# Altium schematic sheet PowerSupply.SchDoc
size Letter
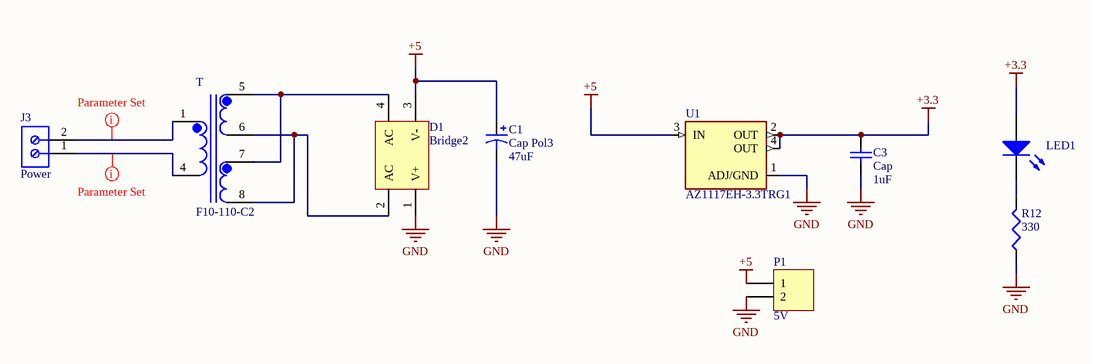
[diagram p0: PowerSupply.SchDoc]

## Parts
C1  Cap Pol3  value 47uF  [2.5mmCap]
C3  Cap  value 1uF  [1608[0603]]
D1  Bridge2  [SOP250P700X300-4N]
J3  Power  [691137710002]
LED1  150120BS75000  [1206_A]  (value not drawn)
P1  5V  [HDR1X2H]
R12  value 330  [1608[0603]]  (hidden comment: Res3)
T  F10-110-C2  [XFMR_F10-110]
U1  AZ1117EH-3.3TRG1  [SOT230P700X180-4N]

## Nets
+3.3: C3.2 LED1.2(A) U1.2(OUT) U1.4(OUT)
+5: C1.1 D1.3(V-) P1.1 U1.3(IN)
GND: C1.2 C3.1 D1.1(V+) P1.2 R12.1 U1.1(ADJ/GND)
NetD1_2: D1.2(AC) T.6 T.8
NetD1_4: D1.4(AC) T.5 T.7
NetJ3_1: J3.1 T.4
NetJ3_2: J3.2 T.1
NetLED1_1: LED1.1(K) R12.2

## Layout directives
rule Width Constraint [Pref Width = 2mm    Min Width = 2mm    Max Width = 2mm]: NetJ3_1, NetJ3_2

## Library data of the parts
C1 = Cap Pol3: Polarized Capacitor (Surface Mount); Published: 8-Jun-2000; LatestRevisionDate: 29-May-2009; LatestRevisionNote: IPC-7351 Footprint Added.; PackageReference: C0805; Publisher: Altium Limited; PackageDescription: Chip Capacitor
C3 = Cap: Capacitor; Published: 8-Jun-2000; LatestRevisionDate: 17-Jul-2002; LatestRevisionNote: Re-released for DXP Platform.; PackageReference: RAD-0.3; Publisher: Altium Limited; PackageDescription: Radial Cap, Thru-Hole; 2 Leads; 0.3 in Pin Spacing
D1 = Bridge2: Diode Bridge; pin to pad: 1>2 2>3 3>1; Published: 24-Mar-1999; LatestRevisionDate: 17-Jul-2002; LatestRevisionNote: Re-released for DXP Platform.; PackageReference: D-46_6A; Publisher: Altium Limited; PackageDescription: Bridge Rectifier; 4 Terminals; Body 16.8 x 16.8 mm (typ); Pitch 10.67 mm
J3 = CMP-1502-03324-1: Series 1377 - 5.00 mm Horizontal Entry with Pressure Clamp WR-TBL, 2 pin; Manufacturer: Wurth Elektronik; Pin Number: 2; Pitch: 5.00mm; Operating Temperature: -30to120degC; Package Reference: 691137710002; Publisher: WurthElektronik; Mounting Technology: THT; Manufacturer URL: http://www.we-online.de; Packaging: Box; Part Number: 691137710002; Datasheet URL: http://katalog.we-online.de/pbs/datasheet/691137710002.pdf
LED1 = CMP-1426-00015-1: SMD mono-color Chip LED, WL-SMCW, Blue; Manufacturer: Wuerth Elektronik; ComponentLink2Description: Datasheet; ComponentLink1URL: http://www.we-online.com; PartNumber: 150120BS75000; ComponentLink1Description: Manufacturer URL; ComponentLink2URL: http://katalog.we-online.com/led/datasheet/150120BS75000.pdf; PackageReference: 1206_A; Color: Blue
P1 = Header 2H: Header, 2-Pin, Right Angle; LatestRevisionDate: 17-Jul-2002; LatestRevisionNote: Re-released for DXP Platform.; Publisher: Altium Limited
R12 = Res3_2: Resistor; Published: 8-Jun-2000; LatestRevisionDate: 29-May-2009; LatestRevisionNote: IPC-7351 Footprint Added.; PackageReference: J1-0603; Publisher: Altium Limited; PackageDescription: Chip Resistor; LCSC Part #: C25804
T = F10-110-C2: F10 Series Single Primary Dual Secondary Split Bobbin Class 2 Transformer; MF: Triad Magnetics; Digi-Key_Part_Number: 237-1557-ND; Package: Triad Magnetics; Value: *; SnapEDA_Link: https://www.snapeda.com/parts/F10-110-C2/Triad%20Magnetics/view-part/2768214/?ref=snap; Digi-Key_Purchase_URL: https://www.digikey.in/product-detail/en/triad-magnetics/F10-110-C2/237-1557-ND/3986429?utm_source=snapeda&utm_medium=aggregator&utm_campaign=symbol; MP: F10-110-C2
U1 = AZ1117EH-3.3TRG1: Linear Voltage Regulator IC 1 Output 1A SOT-223; MF: Diodes Inc.; Package: SOT-223 Diodes Inc.; Value: *; Price: None; MP: AZ1117EH-3.3TRG1; SnapEDA_Link: https://www.snapeda.com/parts/AZ1117EH-3.3TRG1/Diodes%20Inc./view-part/482930/?ref=snap; Availability: Unavailable